# Altium schematic sheet ECG.SchDoc
size A3
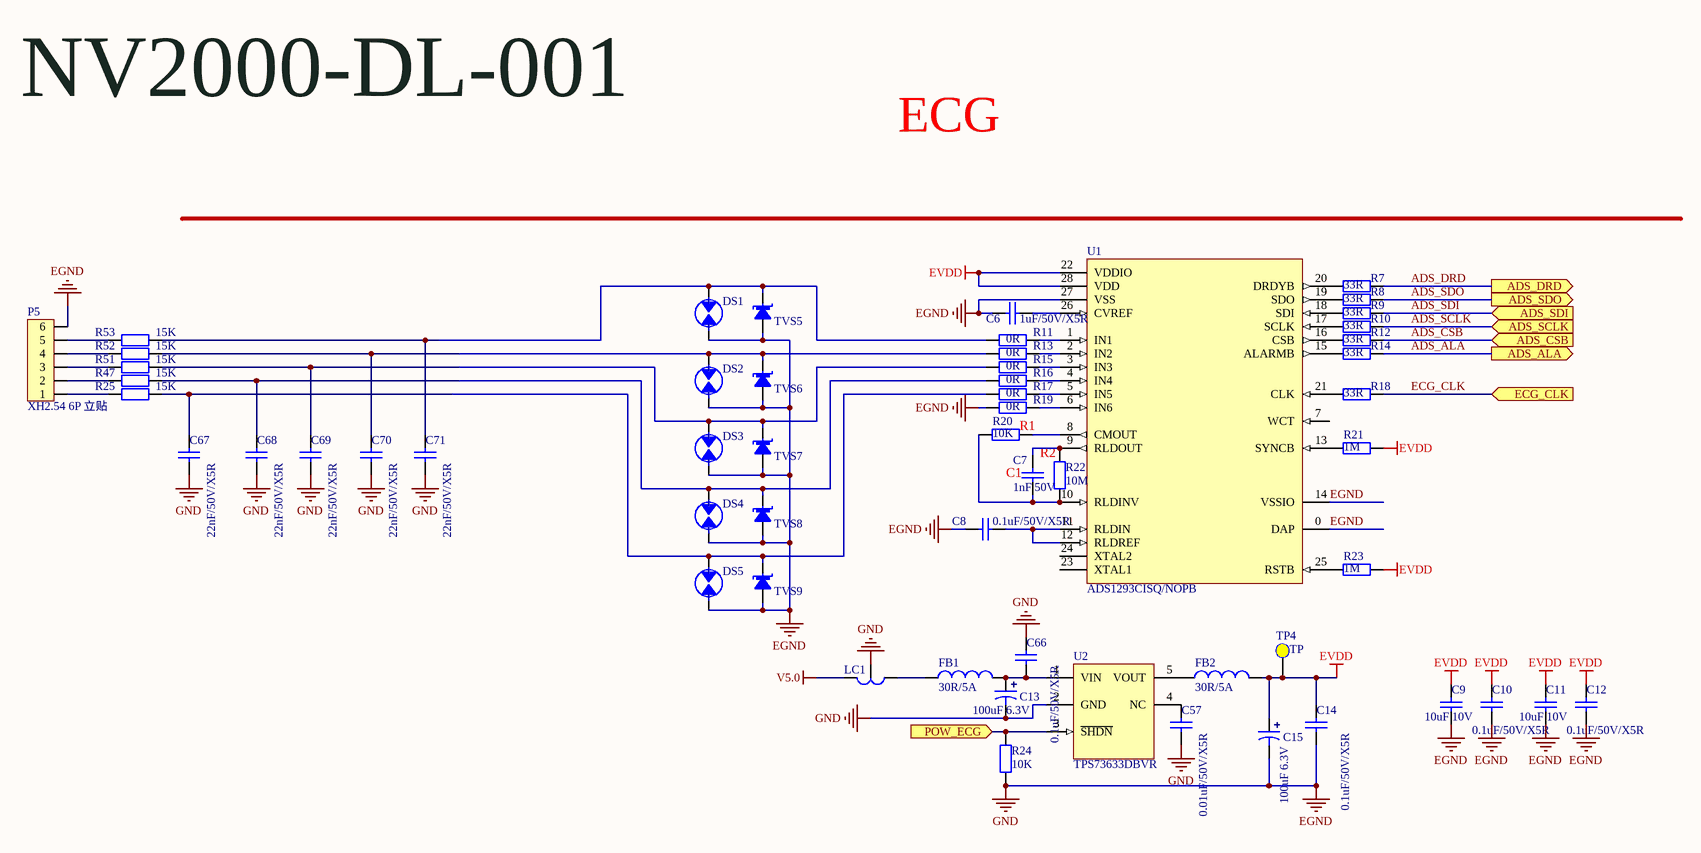
[diagram p0: ECG.SchDoc]

## Parts
C6  1uF/50V/X5R  [SMD-0603C]
C7  1nF 50V  [SMD-0603C]
C8  0.1uF/50V/X5R  [SMD-0603C]
C9  10uF 10V  [SMD-0603C]
C10  0.1uF/50V/X5R  [SMD-0603C]
C11  10uF 10V  [SMD-0603C]
C12  0.1uF/50V/X5R  [SMD-0603C]
C13  100uF 6.3V  [SMD-3528-B]
C14  0.1uF/50V/X5R  [SMD-0603C]
C15  100uF 6.3V  [SMD-3528-B]
C57  0.01uF/50V/X5R  [SMD-0603C]
C66  0.1uF/50V/X5R  [SMD-0603C]
C67  22nF/50V/X5R  [SMD-0603C]
C68  22nF/50V/X5R  [SMD-0603C]
C69  22nF/50V/X5R  [SMD-0603C]
C70  22nF/50V/X5R  [SMD-0603C]
C71  22nF/50V/X5R  [SMD-0603C]
DS1  UN1812-90CSMD  [SMD-1812]  (value not drawn)
DS2  UN1812-90CSMD  [SMD-1812]  (value not drawn)
DS3  UN1812-90CSMD  [SMD-1812]  (value not drawn)
DS4  UN1812-90CSMD  [SMD-1812]  (value not drawn)
DS5  UN1812-90CSMD  [SMD-1812]  (value not drawn)
FB1  30R/5A  [0603r]
FB2  30R/5A  [0603r]
LC1  NFM18PC104R1C3  [NFM21P-0805]  (value not drawn)
P5  XH2.54 6P 立贴  [XH-2.54-6P-LI]
R7  33R  [SMD-0603]
R8  33R  [SMD-0603]
R9  33R  [SMD-0603]
R10  33R  [SMD-0603]
R11  0R  [SMD-0805]
R12  33R  [SMD-0603]
R13  0R  [SMD-0805]
R14  33R  [SMD-0603]
R15  0R  [SMD-0805]
R16  0R  [SMD-0805]
R17  0R  [SMD-0805]
R18  33R  [SMD-0603]
R19  0R  [SMD-0805]
R20  10K  [SMD-0603]
R21  1M  [SMD-0603]
R22  10M  [SMD-0603]
R23  1M  [SMD-0603]
R24  10K  [SMD-0603]
R25  15K  [SMD-0603]
R47  15K  [SMD-0603]
R51  15K  [SMD-0603]
R52  15K  [SMD-0603]
R53  15K  [SMD-0603]
TP4  TP  [TP]
TVS5  TVS-S  [SOD-323]  (value not drawn)
TVS6  TVS-S  [SOD-323]  (value not drawn)
TVS7  TVS-S  [SOD-323]  (value not drawn)
TVS8  TVS-S  [SOD-323]  (value not drawn)
TVS9  TVS-S  [SOD-323]  (value not drawn)
U1  ADS1293CISQ/NOPB  [QFN-28]
U2  TPS73633DBVR  [SOT23-5]

## Ports
ADS_ALA (out), ADS_CSB (in), ADS_DRD (out), ADS_SCLK (in), ADS_SDI (in), ADS_SDO (out), ECG_CLK (in), POW_ECG (in)

## Nets
EGND: C6.1 C8.1 C9.1 C10.1 C11.1 C12.1 C13.2 C14.1 C15.2 C57.1 C66.2 C67.1 C68.1 C69.1 C70.1 C71.1 DS1.2 DS2.2 DS3.2 DS4.2 DS5.2 LC1.2 P5.6 R19.1 R24.2 TVS5.1(A) TVS6.1(A) TVS7.1(A) TVS8.1(A) TVS9.1(A) U1.0(DAP) U1.14(VSSIO) U1.27(VSS) U2.2(GND)  [also labelled GND]
EVDD: C9.2 C10.2 C11.2 C12.2 C14.2 C15.1 FB2.2 R21.1 R23.1 TP4.1(TP) U1.22(VDDIO) U1.28(VDD)
V5.0: LC1.3
ADS_ALA: R14.1 ; port ADS_ALA
ADS_CSB: R12.1 ; port ADS_CSB
ADS_DRD: R7.1 ; port ADS_DRD
ADS_SCLK: R10.1 ; port ADS_SCLK
ADS_SDI: R9.1 ; port ADS_SDI
ADS_SDO: R8.1 ; port ADS_SDO
ECG_CLK: R18.1 ; port ECG_CLK
POW_ECG: R24.1 U2.3(~{SHDN}) ; port POW_ECG
NetC6_2: C6.2 U1.26(CVREF)
NetC7_1: C7.1 R22.1 U1.9(RLDOUT)
NetC7_2: C7.2 R20.2 R22.2 U1.10(RLDINV)
NetC8_2: C8.2 U1.11(RLDIN) U1.12(RLDREF)
NetC13_1: C13.1 C66.1 FB1.2 U2.1(VIN)
NetC57_2: C57.2 U2.4(NC)
NetC67_2: C67.2 DS5.1 R17.1 R25.2 TVS9.2(B)
NetC68_2: C68.2 DS4.1 R16.1 R47.2 TVS8.2(B)
NetC69_2: C69.2 DS3.1 R15.1 R51.2 TVS7.2(B)
NetC70_2: C70.2 DS2.1 R13.1 R52.2 TVS6.2(B)
NetC71_2: C71.2 DS1.1 R11.1 R53.2 TVS5.2(B)
NetFB1_1: FB1.1 LC1.1
NetFB2_1: FB2.1 U2.5(VOUT)
NetP5_1: P5.1 R25.1
NetP5_2: P5.2 R47.1
NetP5_3: P5.3 R51.1
NetP5_4: P5.4 R52.1
NetP5_5: P5.5 R53.1
NetR7_2: R7.2 U1.20(DRDYB)
NetR8_2: R8.2 U1.19(SDO)
NetR9_2: R9.2 U1.18(SDI)
NetR10_2: R10.2 U1.17(SCLK)
NetR11_2: R11.2 U1.1(IN1)
NetR12_2: R12.2 U1.16(CSB)
NetR13_2: R13.2 U1.2(IN2)
NetR14_2: R14.2 U1.15(ALARMB)
NetR15_2: R15.2 U1.3(IN3)
NetR16_2: R16.2 U1.4(IN4)
NetR17_2: R17.2 U1.5(IN5)
NetR18_2: R18.2 U1.21(CLK)
NetR19_2: R19.2 U1.6(IN6)
NetR20_1: R20.1 U1.8(CMOUT)
NetR21_2: R21.2 U1.13(SYNCB)
NetR23_2: R23.2 U1.25(RSTB)

Not connected (* = marked no-connect by the designer): U1 7(WCT) 23(XTAL1) 24(XTAL2)

## Notes on the sheet
- NV2000-DL-001
- ECG
- (near R20) R1
- R2
- (near C7) C1

## Library data of the parts
C6 C8 C10 C12 C14 C57 C66-C71 = CAP4: 贴片电容 10%
C7 = CAP4: 贴片电容 5%
C9 C11 = CAP4: 贴片电容 20%
C13 C15 = CAP2: 钽电容
DS1-DS5 = DISCHARE-1: 气体放电管 90V
FB1 FB2 = Inductor: Code_IEC: 1005; Value: 10mH; Published: 8-Jun-2000; LatestRevisionDate: 29-May-2009; LatestRevisionNote: IPC-7351 Footprint Added.; PackageReference: 0402-A; Publisher: Altium Limited; PackageDescription: Chip Inductor; Code_JEITA: 0402
LC1 = SMD-EMIFIL-0603: LC滤波器
P5 = SIP-6: 心电接口
R7-R19 R21 R23 = RES0: 贴片电阻 5%
R20 R22 R24 R25 R47 R51-R53 = RES0: 贴片电阻 1%
TP4 = TP_POINT
TVS5-TVS9 = TVS-S: 单向TVS
U1 = ADS1293: ECG AFE
U2 = MCP1802: LDO